# EAGLE design camera-remote (EAGLE 5.11)
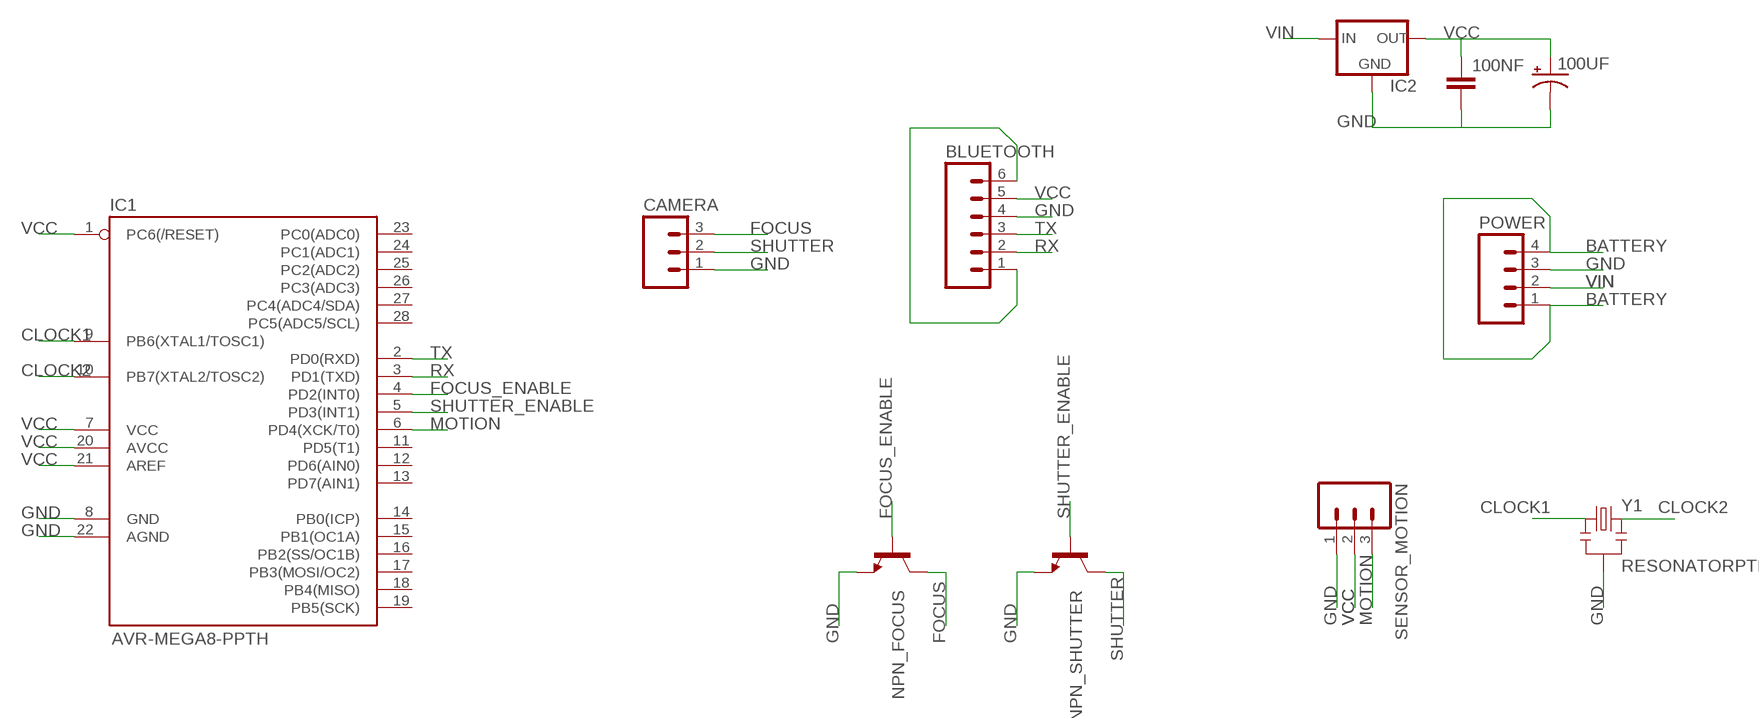
[diagram p0: schematic, sheet 1]

## Parts
100NF  CAPPTH1  [CAP-PTH-5MM]
100UF  CAP_POLPTH1  [CPOL-RADIAL-100UF-25V]
BLUETOOTH  M06SIP  [1X06]
CAMERA  M03PTH  [1X03]
IC1  AVR-MEGA8-PPTH  [DIL28-3]
IC2  V_REG_78XX-TO-220  [TO-220-ALT]
NPN_FOCUS  TRANSISTOR_NPNTO-92-AMMO  [TO-92-AMMO]
NPN_SHUTTER  TRANSISTOR_NPNTO-92-AMMO  [TO-92-AMMO]
POWER  M04PTH  [1X04]
SENSOR_MOTION  M03PTH  [1X03]
Y1  RESONATORPTH  [RESONATOR-PTH]

## Nets
BATTERY: POWER.1 POWER.4
BLUETOOTH: BLUETOOTH.1 BLUETOOTH.6
CLOCK1: IC1.9(PB6(XTAL1/TOSC1)) Y1.1
CLOCK2: IC1.10(PB7(XTAL2/TOSC2)) Y1.3
FOCUS: CAMERA.3 NPN_FOCUS.3(C)
FOCUS_ENABLE: IC1.4(PD2(INT0)) NPN_FOCUS.2(B)
GND: 100NF.2 100UF.2(-) BLUETOOTH.4 CAMERA.1 IC1.8(GND) IC1.22(AGND) IC2.GND NPN_FOCUS.1(E) NPN_SHUTTER.1(E) POWER.3 SENSOR_MOTION.1 Y1.2
MOTION: IC1.6(PD4(XCK/T0)) SENSOR_MOTION.3
RX: BLUETOOTH.2 IC1.3(PD1(TXD))
SHUTTER: CAMERA.2 NPN_SHUTTER.3(C)
SHUTTER_ENABLE: IC1.5(PD3(INT1)) NPN_SHUTTER.2(B)
TX: BLUETOOTH.3 IC1.2(PD0(RXD))
VCC: 100NF.1 100UF.1(+) BLUETOOTH.5 IC1.1(PC6(/RESET)) IC1.7(VCC) IC1.20(AVCC) IC1.21(AREF) IC2.OUT SENSOR_MOTION.2
VIN: IC2.IN POWER.2
Unconnected: IC1.11(PD5(T1)) IC1.12(PD6(AIN0)) IC1.13(PD7(AIN1)) IC1.14(PB0(ICP)) IC1.15(PB1(OC1A)) IC1.16(PB2(SS/OC1B)) IC1.17(PB3(MOSI/OC2)) IC1.18(PB4(MISO)) IC1.19(PB5(SCK)) IC1.23(PC0(ADC0)) IC1.24(PC1(ADC1)) IC1.25(PC2(ADC2)) IC1.26(PC3(ADC3)) IC1.27(PC4(ADC4/SDA)) IC1.28(PC5(ADC5/SCL))

## Library data of the parts
100NF = SparkFun:CAP: Capacitor Standard 0603 ceramic capacitor, and 0.1" leaded capacitor.
100UF = SparkFun:CAP_POL: Capacitor Polarized These are standard SMD and PTH capacitors. Normally 10uF, 47uF, and 100uF in electrolytic and tantalum varieties. Always verify the external diameter of the through hole cap, it varies with capacity, voltage, and manufacturer. The EIA devices should be standard.
BLUETOOTH = SparkFun:M06: Header 6 Standard 6-pin 0.1" header. Use with straight break away headers (SKU : PRT-00116), right angle break away headers (PRT-00553), swiss pins (PRT-00743), machine pins (PRT-00117), and female headers (PRT-00115). Molex polarized connector foot print use with SKU : PRT-08094 with associated crimp pins and housings. NOTES ON THE VARIANTS LOCK and LOCK_LONGPADS... This footprint was designed to help hold the alignment of a through-hole component (i.e. 6-pin header) while soldering it into place. You may notice that each hole has been shifted either up or down by 0.005 of an inch from it's more standard position (which is a perfectly straight line). This slight alteration caused the pins (the squares in the middle) to touch the edges of the holes. Because they are alternating, it causes a "brace" to hold the component in place. 0.005 has proven to be the perfect amount of "off-center" position when using our standard breakaway headers. Although looks a little odd when you look at the bare footprint, once you have a header in there, the alteration is very hard to notice. Also, if you push a header all the way into place, it is covered up entirely on the bottom side. This idea of altering the position of holes to aid alignment will be further integrated into the Sparkfun Library for other footprints. It can help hold any component with 3 or more connection pins.
CAMERA SENSOR_MOTION = SparkFun:M03: Header 3 Standard 3-pin 0.1" header. Use with straight break away headers (SKU : PRT-00116), right angle break away headers (PRT-00553), swiss pins (PRT-00743), machine pins (PRT-00117), and female headers (PRT-00115). Molex polarized connector foot print use with SKU : PRT-08232 with associated crimp pins and housings.
IC1 = SparkFun:AVR-MEGA8-P: MICROCONTROLLER 8 Kbytes FLASH 1 kbytes SRAM 512 bytes EEPROM USART 4-channel 10 bit ADC 2-channel 8 bit ADC
IC2 = SparkFun:V_REG_78XX: Voltage Regulator Standard 7805 5V regulator. IGO (Input Ground Output). Spark Fun Electronics SKU : COM-00107
NPN_FOCUS NPN_SHUTTER = SparkFun:TRANSISTOR_NPN: Transistor NPN BJT configuration in SOT23 package. MMBT2222 is the common NPN we use. Double check BCE configuration again layout.
POWER = SparkFun:M04: Header 4 Standard 4-pin 0.1" header. Use with straight break away headers (SKU : PRT-00116), right angle break away headers (PRT-00553), swiss pins (PRT-00743), machine pins (PRT-00117), and female headers (PRT-00115). Molex polarized connector foot print use with SKU : PRT-08231 with associated crimp pins and housings. 1MM SMD Version SKU: PRT-10208
Y1 = SparkFun:RESONATOR: Resonator Small SMD resonator. This is the itty bitty 10/20MHz resonators with built in caps. CSTCE10M0G55 and CSTCE20M0V53. Footprint has been reviewed closely but hasn't been tested yet.

## Board
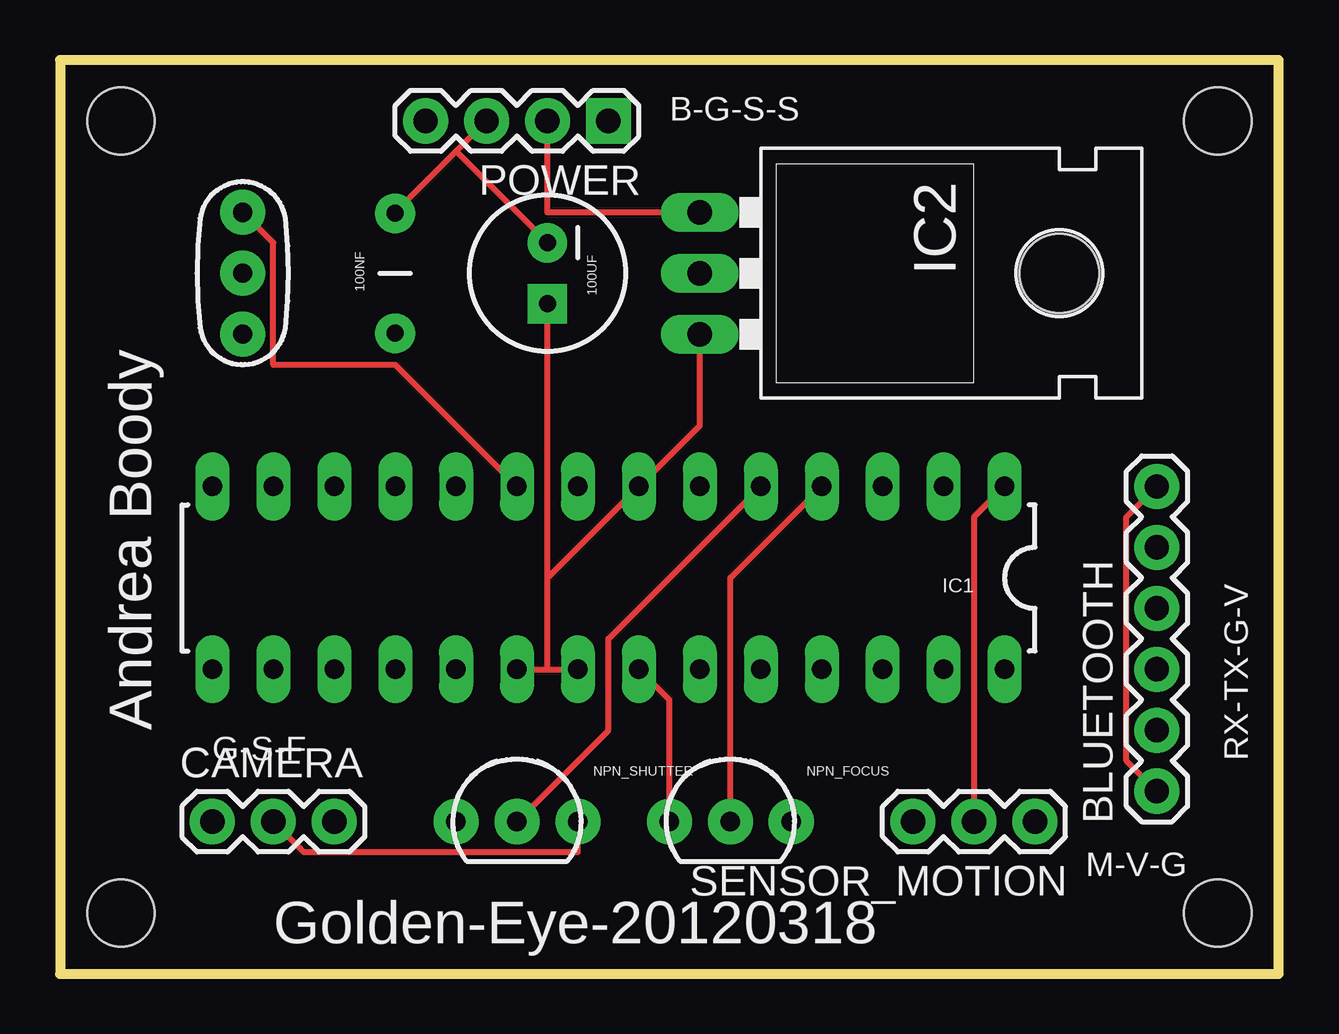
[diagram p1: board, top side]
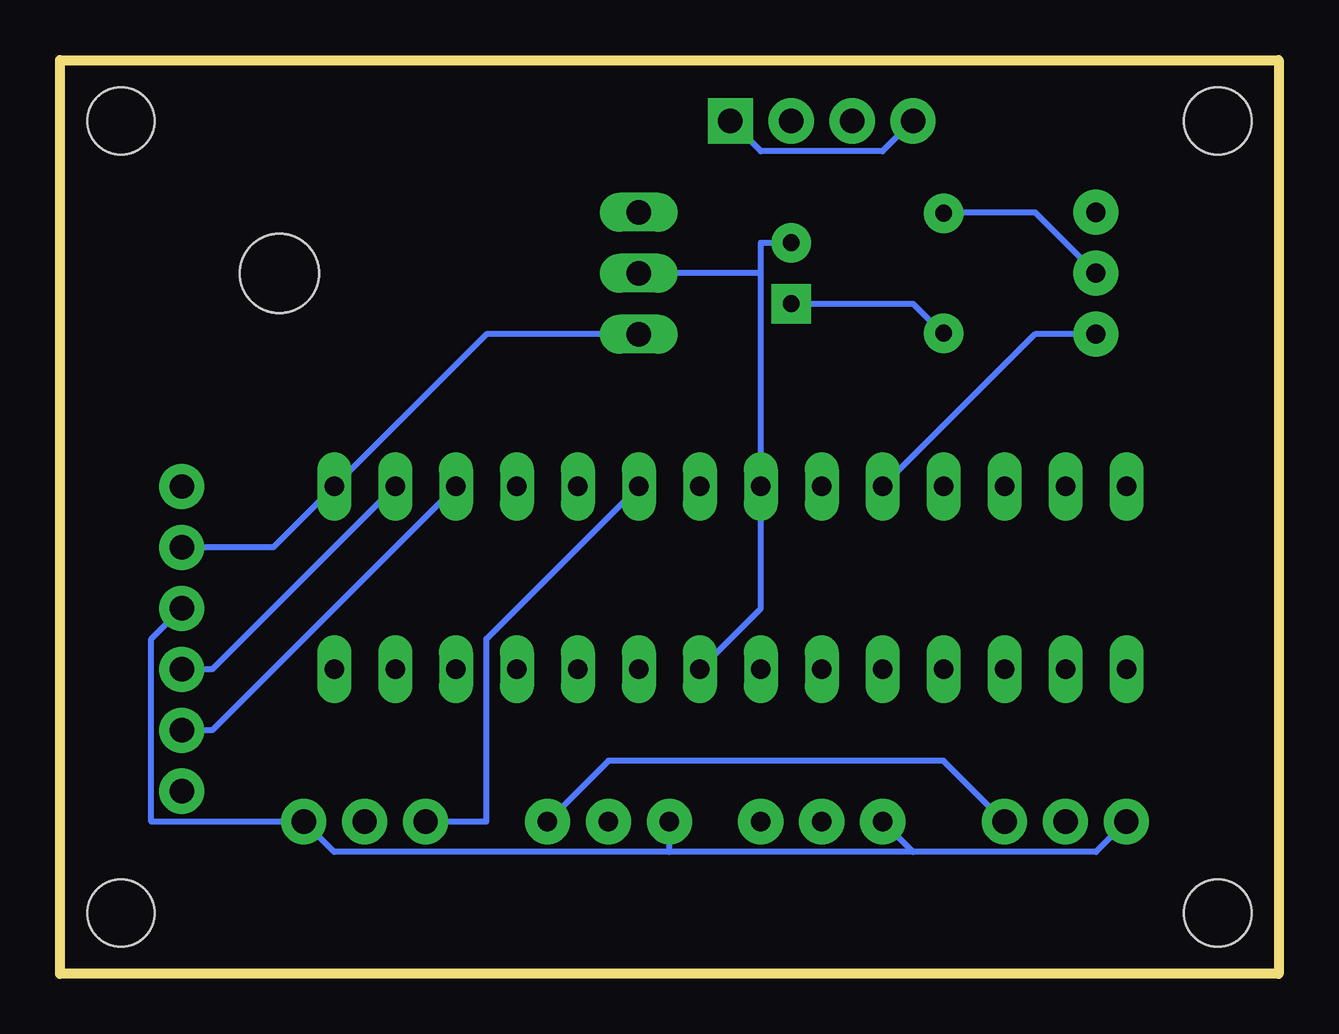
[diagram p2: board, bottom side, seen from below]

Size 50.8 x 38.1 mm. Coordinates in mm from the lower left corner, seen from the top.
Outline: 0,0 50.8,0 50.8,38.1 0,38.1 0,0
Copper layers (1*16): Top 0.035mm / dielectric 1.5mm / Bottom 0.035mm
Design rules "SparkFun": minimum track width 8mil, minimum drill 20mil, track to track 8mil, track to pad 8mil, pad to pad 8mil, via to via 8mil, smd to smd 8mil, copper to edge 10mil, drill to drill 8mil, minimum pad ring 12mil, minimum via ring 10mil, stop-mask expansion 4mil, vias tented up to drill 25mil, thermal gap 10mil
Holes 2.8 mm at 2.54,2.54 48.26,2.54 48.26,35.56 2.54,35.56

### Footprints (pad centres in the part's own frame; a part is rotated, then mirrored left to right if it is on the bottom)
CAP-PTH-5MM = drill 0.7 pad 1.651 round: 1 -2.5,0; 2 2.5,0
CPOL-RADIAL-100UF-25V = drill 0.7 pad 1.651 square: 1 1.27,0 | drill 0.7 pad 1.651 round: 2 -1.27,0
1X06 = drill 1.016 pad 1.88 round: 1 0,0; 2 2.54,0; 3 5.08,0; 4 7.62,0; 5 10.16,0; 6 12.7,0
1X03 = drill 1.016 pad 1.88 round: 1 0,0; 2 2.54,0; 3 5.08,0
DIL28-3 = drill 0.813 long: 1 -16.51,-3.81; 2 -13.97,-3.81; 3 -11.43,-3.81; 4 -8.89,-3.81; 5 -6.35,-3.81; 6 -3.81,-3.81; 7 -1.27,-3.81; 8 1.27,-3.81; 9 3.81,-3.81; 10 6.35,-3.81; 11 8.89,-3.81; 12 11.43,-3.81; 13 13.97,-3.81; 14 16.51,-3.81; 15 16.51,3.81; 16 13.97,3.81; 17 11.43,3.81; 18 8.89,3.81; 19 6.35,3.81; 20 3.81,3.81; 21 1.27,3.81; 22 -1.27,3.81; 23 -3.81,3.81; 24 -6.35,3.81; 25 -8.89,3.81; 26 -11.43,3.81; 27 -13.97,3.81; 28 -16.51,3.81
TO-220-ALT = drill 1.016 long: GND 0,-3.81; IN -2.54,-3.81; OUT 2.54,-3.81 | hole 3.302: 0,11.176
TO-92-AMMO = drill 0.813 pad 1.88 round: 1 -2.54,0; 2 0,0; 3 2.54,0
1X04 = drill 1.016 pad 1.88 square: 1 0,0 | drill 1.016 pad 1.88 round: 2 2.54,0; 3 5.08,0; 4 7.62,0
RESONATOR-PTH = drill 0.8 pad 1.88 round: 1 -2.54,0; 2 0,0; 3 2.54,0

### Placement (x,y rotation side)
100NF  13.97,29.21 90 top
100UF  20.32,29.21 270 top
BLUETOOTH  45.72,7.62 90 top
CAMERA  6.35,6.35 0 top
IC1  22.86,16.51 180 top
IC2  30.48,29.21 270 top
NPN_FOCUS  27.94,6.35 0 top
NPN_SHUTTER  19.05,6.35 0 top
POWER  22.86,35.56 180 top
SENSOR_MOTION  40.64,6.35 180 top
Y1  7.62,29.21 270 top

### Tracks (layer width: path | path; a pad name or v marks a point on that pad's centre or on a via)
BATTERY
  Bottom 0.254: POWER.4 16.51,34.29 21.59,34.29 POWER.1
BLUETOOTH
  Top 0.254: BLUETOOTH.1 44.45,8.89 44.45,19.05 BLUETOOTH.6
CLOCK1
  Top 0.254: IC1.9 13.97,25.4 8.89,25.4 8.89,30.48 Y1.1
CLOCK2
  Bottom 0.254: IC1.10 10.16,26.67 Y1.3
FOCUS
  Bottom 0.254: CAMERA.3 13.97,8.89 27.94,8.89 NPN_FOCUS.3
FOCUS_ENABLE
  Top 0.254: IC1.4 27.94,16.51 NPN_FOCUS.2
GND
  Top 0.254: 16.51,34.29 POWER.3 | 16.51,34.29 13.97,31.75 100NF.2 | 100UF.2 16.51,34.29 | IC1.22 25.4,11.43 NPN_FOCUS.1
  Bottom 0.254: 21.59,29.21 21.59,30.48 100UF.2 | 21.59,29.21 IC1.8 21.59,15.24 IC1.22 | 21.59,29.21 IC2.GND | Y1.2 10.16,31.75 13.97,31.75 100NF.2 | CAMERA.1 7.62,5.08 15.24,5.08 | 15.24,5.08 NPN_SHUTTER.1 | 15.24,5.08 25.4,5.08 | 25.4,5.08 39.37,5.08 SENSOR_MOTION.1 46.99,6.35 46.99,13.97 BLUETOOTH.4 | 25.4,5.08 NPN_FOCUS.1
MOTION
  Bottom 0.254: IC1.6 33.02,13.97 33.02,6.35 SENSOR_MOTION.3
RX
  Bottom 0.254: IC1.3 44.45,10.16 BLUETOOTH.2
SHUTTER
  Top 0.254: CAMERA.2 10.16,5.08 21.59,5.08 NPN_SHUTTER.3
SHUTTER_ENABLE
  Top 0.254: IC1.5 22.86,13.97 22.86,10.16 NPN_SHUTTER.2
TX
  Bottom 0.254: IC1.2 44.45,12.7 BLUETOOTH.3
VCC
  Top 0.254: SENSOR_MOTION.2 38.1,19.05 IC1.1 | IC2.OUT 26.67,22.86 IC1.7 20.32,16.51 | 20.32,12.7 IC1.21 | IC1.20 20.32,12.7 | 20.32,16.51 100UF.1 | 20.32,12.7 20.32,16.51
  Bottom 0.254: BLUETOOTH.5 41.91,17.78 IC1.1 33.02,26.67 IC2.OUT | 100UF.1 15.24,27.94 13.97,26.67 100NF.1
VIN
  Top 0.254: IC2.IN 20.32,31.75 POWER.2

### Text on the board
tPlace: B-G-S-S | Andrea Boody | G-S-F | RX-TX-G-V | M-V-G | Golden-Eye-20120318